# Altium schematic sheet NBT_VGA.SCHDOC
size A4; Organization: Altium Limited; Address1: L3, 12a Rodborough Rd; Address2: Frenchs Forest; Address3: NSW; Address4: Australia 2086; DocumentNumber: 11; SheetNumber: 11; SheetTotal: 12
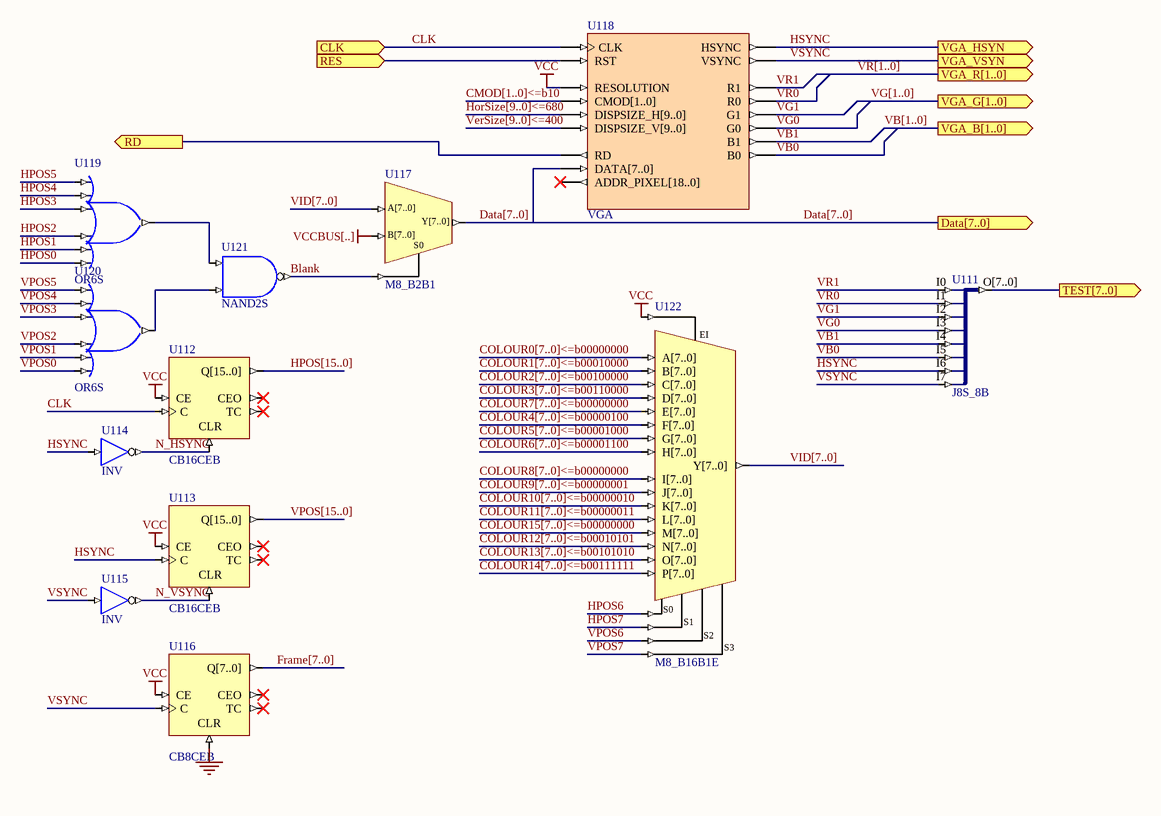
[diagram p0: NBT_VGA.SCHDOC]

## Parts
U111  J8S_8B
U112  CB16CEB
U113  CB16CEB
U114  INV
U115  INV
U116  CB8CEB
U117  M8_B2B1
U118  VGA
U119  OR6S
U120  OR6S
U121  NAND2S
U122  M8_B16B1E

## Ports
CLK (in), Data[7..0] (out), RD (out), RES (in), TEST[7..0] (out), VGA_B[1..0] (out), VGA_G[1..0] (out), VGA_HSYN (out), VGA_R[1..0] (out), VGA_VSYN (out)

## Nets
GND: U116.CLR
VCC: U112.CE U113.CE U116.CE U118.RESOLUTION U122.EI
VCCBUS[..]: U117.B[7..0]
Blank: U117.S0 U121.O
CLK: U112.C U118.CLK ; port CLK
CMOD[1..0]<=b10: U118.CMOD[1..0]
COLOUR0[7..0]<=b00000000: U122.A[7..0]
COLOUR1[7..0]<=b00010000: U122.B[7..0]
COLOUR2[7..0]<=b00100000: U122.C[7..0]
COLOUR3[7..0]<=b00110000: U122.D[7..0]
COLOUR4[7..0]<=b00000100: U122.F[7..0]
COLOUR5[7..0]<=b00001000: U122.G[7..0]
COLOUR6[7..0]<=b00001100: U122.H[7..0]
COLOUR7[7..0]<=b00000000: U122.E[7..0]
COLOUR8[7..0]<=b00000000: U122.I[7..0]
COLOUR9[7..0]<=b00000001: U122.J[7..0]
COLOUR10[7..0]<=b00000010: U122.K[7..0]
COLOUR11[7..0]<=b00000011: U122.L[7..0]
COLOUR12[7..0]<=b00010101: U122.N[7..0]
COLOUR13[7..0]<=b00101010: U122.O[7..0]
COLOUR14[7..0]<=b00111111: U122.P[7..0]
COLOUR15[7..0]<=b00000000: U122.M[7..0]
Data[7..0]: U117.Y[7..0] U118.DATA[7..0] ; port Data[7..0]
Frame[7..0]: U116.Q[7..0]
HorSize[9..0]<=680: U118.DISPSIZE_H[9..0]
HPOS0: U119.I5
HPOS1: U119.I4
HPOS2: U119.I3
HPOS3: U119.I2
HPOS4: U119.I1
HPOS5: U119.I0
HPOS6: U122.S0
HPOS7: U122.S1
HPOS[15..0]: U112.Q[15..0]
HSYNC: U111.I6 U113.C U114.I U118.HSYNC ; port VGA_HSYN
N_HSYNC: U112.CLR U114.O
N_VSYNC: U113.CLR U115.O
RD: U118.RD ; port RD
RES: U118.RST ; port RES
TEST[7..0]: U111.O[7..0] ; port TEST[7..0]
VB0: U111.I5 U118.B0
VB1: U111.I4 U118.B1
VerSize[9..0]<=400: U118.DISPSIZE_V[9..0]
VG0: U111.I3 U118.G0
VG1: U111.I2 U118.G1
VID[7..0]: U117.A[7..0] U122.Y[7..0]
VPOS0: U120.I5
VPOS1: U120.I4
VPOS2: U120.I3
VPOS3: U120.I2
VPOS4: U120.I1
VPOS5: U120.I0
VPOS6: U122.S2
VPOS7: U122.S3
VPOS[15..0]: U113.Q[15..0]
VR0: U111.I1 U118.R0
VR1: U111.I0 U118.R1
VSYNC: U111.I7 U115.I U116.C U118.VSYNC ; port VGA_VSYN
NetU119_O: U119.O U121.I0
NetU120_O: U120.O U121.I1

Not connected (* = marked no-connect by the designer): U112 CEO* TC*; U113 CEO* TC*; U116 CEO* TC*; U118 ADDR_PIXEL[18..0]*

## Buses and harness runs
bus CMOD[1..0]<=b10
bus COLOUR0[7..0]<=b00000000
bus COLOUR1[7..0]<=b00010000
bus COLOUR2[7..0]<=b00100000
bus COLOUR3[7..0]<=b00110000
bus COLOUR4[7..0]<=b00000100
bus COLOUR5[7..0]<=b00001000
bus COLOUR6[7..0]<=b00001100
bus COLOUR7[7..0]<=b00000000
bus COLOUR8[7..0]<=b00000000
bus COLOUR9[7..0]<=b00000001
bus COLOUR10[7..0]<=b00000010
bus COLOUR11[7..0]<=b00000011
bus COLOUR12[7..0]<=b00010101
bus COLOUR13[7..0]<=b00101010
bus COLOUR14[7..0]<=b00111111
bus COLOUR15[7..0]<=b00000000
bus Data[7..0] = port Data[7..0]
bus Frame[7..0]
bus HorSize[9..0]<=680
bus HPOS[15..0]
bus VB[1..0] = port VGA_B[1..0]
bus VerSize[9..0]<=400
bus VG[1..0] = port VGA_G[1..0]
bus VID[7..0]
bus VPOS[15..0]
bus VR[1..0] = port VGA_R[1..0]

## Notes on the sheet
- Title
- Size:
- Date:
- A4
- Number:
- Time:
- Revision:
- Sheet
- of
- File:

## Library data of the parts
U111 = J8S_8B: 8 Single pin inputs to single 8-Bit output bus; ArchiveName: GENERIC; Published: 4-Dec-2003; Publisher: Altium Limited; Core Revision: 1.00.00
U112 U113 = CB16CEB: 16-Bit Cascadable Binary Counters with Clock Enable and Asynchronous Clear, Bus Version; Xilinx Equivalent: CB16CE; ArchiveName: GENERIC; Published: 4-Dec-2003; Publisher: Altium Limited; Core Revision: 1.00.00
U114 U115 = INV: Inverter; ArchiveName: GENERIC; Published: 4-Dec-2003; Publisher: Altium Limited; Xilinx Equivalent: INV; Core Revision: 1.00.00
U116 = CB8CEB: 8-Bit Cascadable Binary Counters with Clock Enable and Asynchronous Clear, Bus Version; Xilinx Equivalent: CB8CE; ArchiveName: GENERIC; Published: 4-Dec-2003; Publisher: Altium Limited; Core Revision: 1.00.00
U117 = M8_B2B1: 2x8-Bit Bus to 1x8-Bit Bus Multiplexer; ArchiveName: GENERIC; Published: 4-Dec-2003; Publisher: Altium Limited; Core Revision: 1.00.00
U118 = VGA: VGA Controller; Published: 21/10/2003; Publisher: Altium Hobart Technology Centre; Core Revision: 1.00.00
U119 U120 = OR6S: 6-Input OR Gate, Single Pin Version; Xilinx Equivalent: OR6; ArchiveName: GENERIC; Published: 4-Dec-2003; Publisher: Altium Limited; Core Revision: 1.00.00
U121 = NAND2S: 2-Input NAND Gate, Single Pin Version; Xilinx Equivalent: NAND2; ArchiveName: GENERIC; Published: 4-Dec-2003; Publisher: Altium Limited; Core Revision: 1.00.00
U122 = M8_B16B1E: 16x8-Bit Bus to 1x8-Bit Bus Multiplexer With Enable; ArchiveName: GENERIC; Published: 18-Dec-2003; Publisher: Altium Limited; Core Revision: 1.00.00